# EAGLE design raspberry_aux_board_connectors (EAGLE 9.3.2)

## Sheet 1 of 2
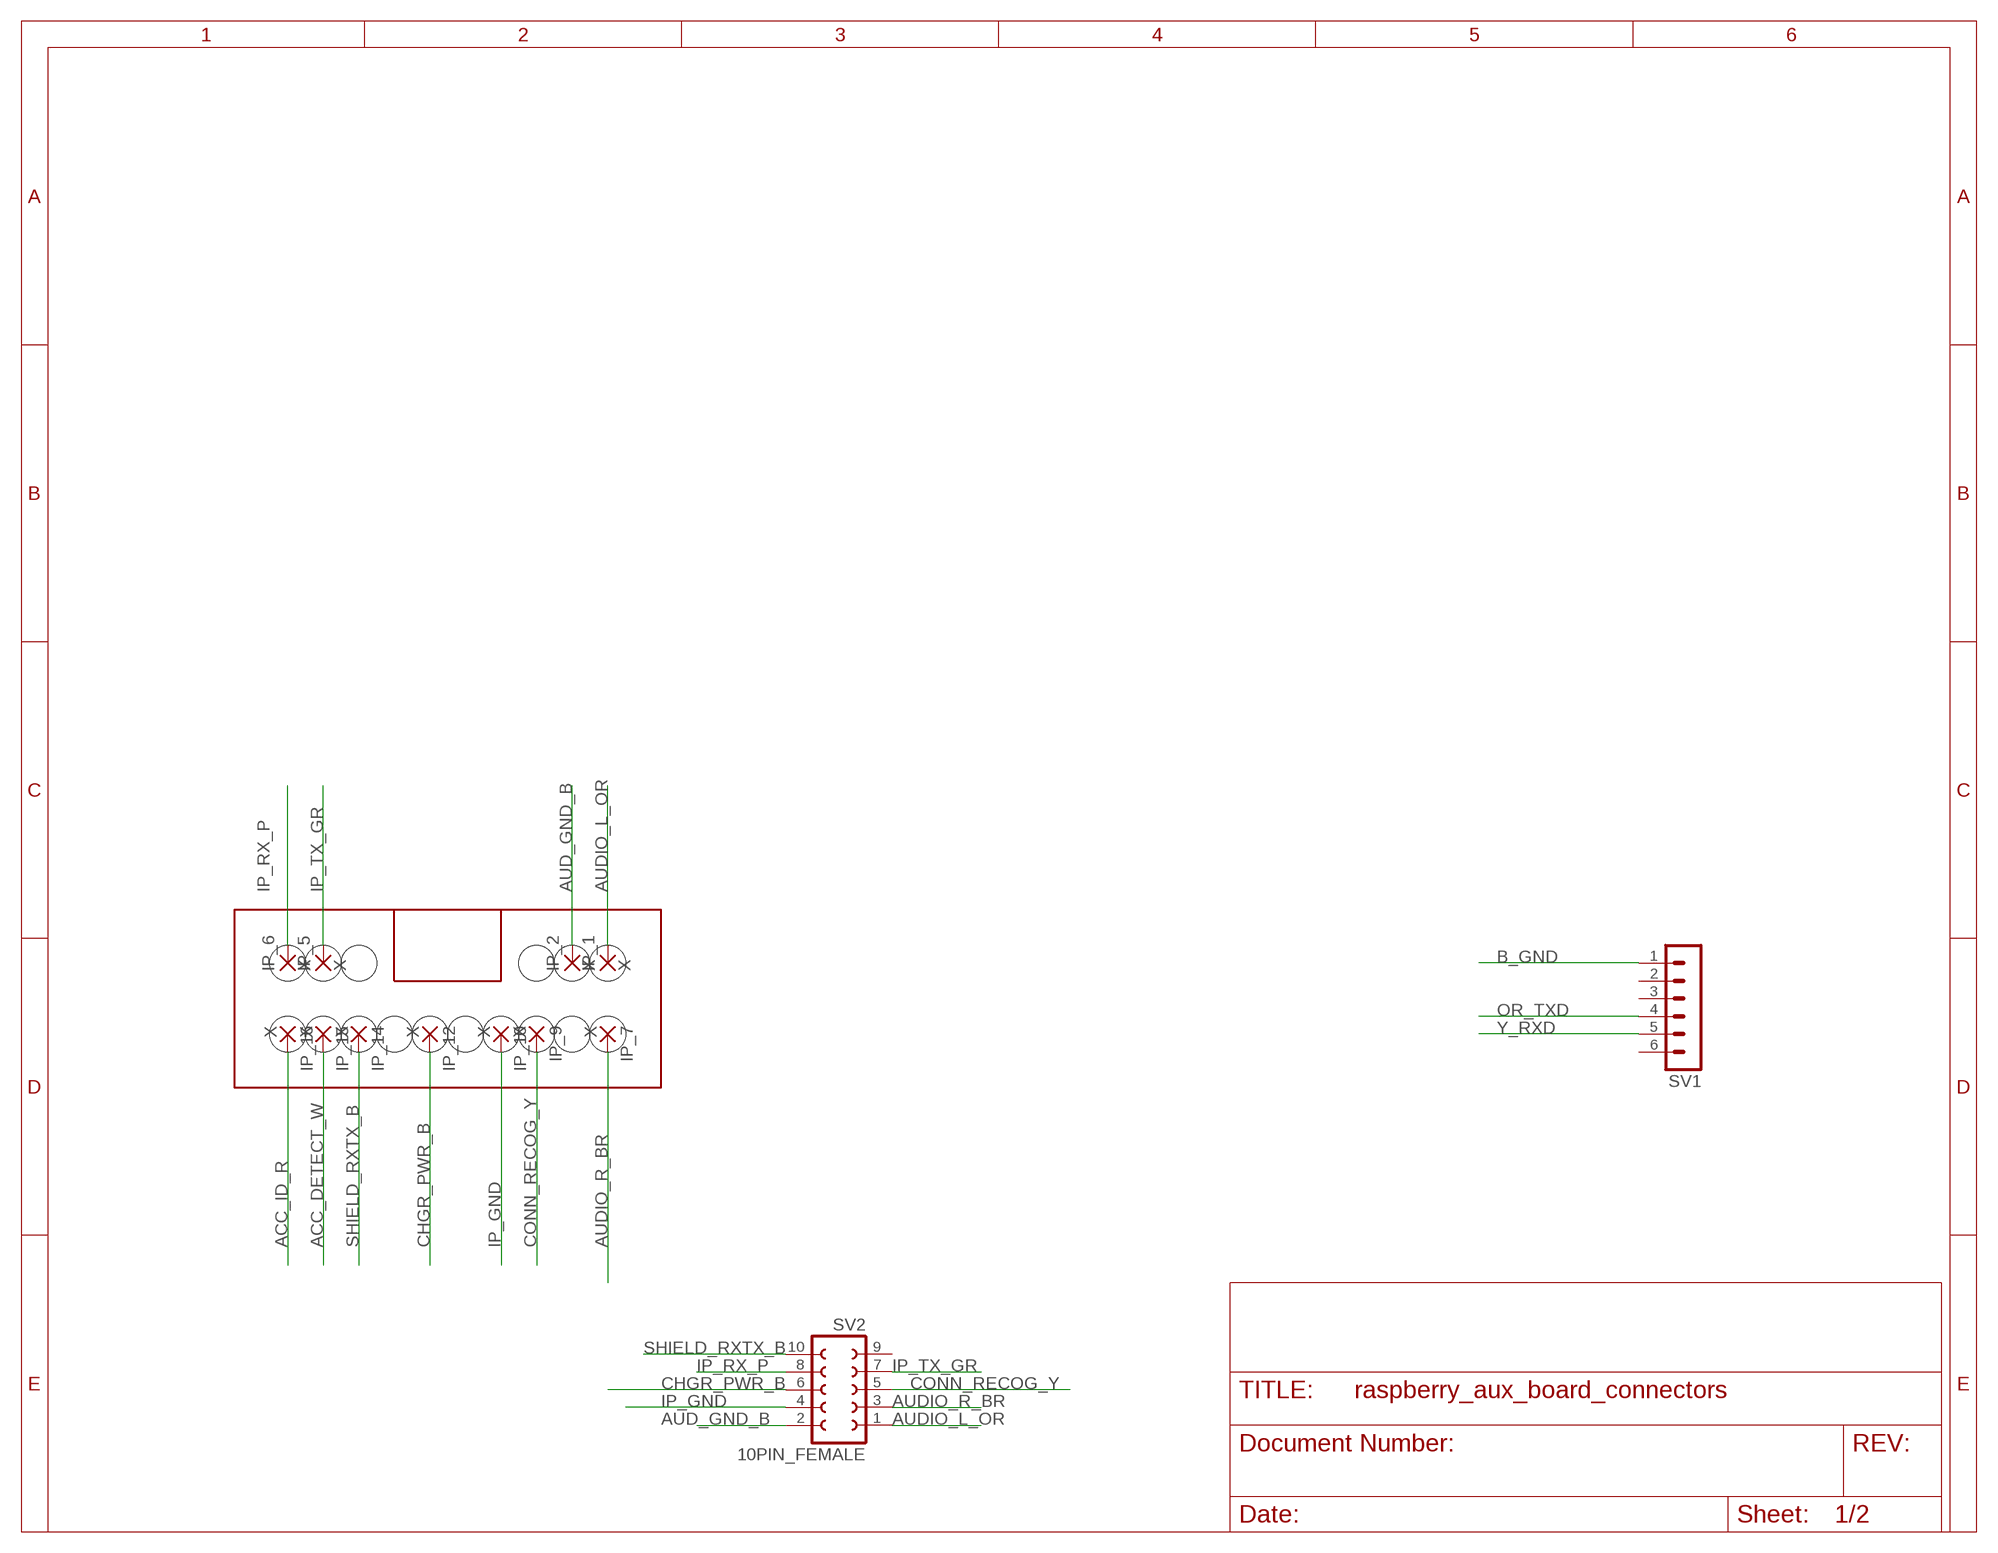
[diagram p0: schematic, sheet 1]

### Parts
IP_1  X  2,15/1,0  [2,15/1,0]
IP_2  X  2,15/1,0  [2,15/1,0]
IP_5  X  2,15/1,0  [2,15/1,0]
IP_6  X  2,15/1,0  [2,15/1,0]
IP_7  X  2,15/1,0  [2,15/1,0]
IP_9  X  2,15/1,0  [2,15/1,0]
IP_10  X  2,15/1,0  [2,15/1,0]
IP_12  X  2,15/1,0  [2,15/1,0]
IP_14  X  2,15/1,0  [2,15/1,0]
IP_15  X  2,15/1,0  [2,15/1,0]
IP_16  X  2,15/1,0  [2,15/1,0]
SV1  MA06-1  [MA06-1]
SV2  10PIN_FEMALE  FE05-2  [FE05-2]

### Nets
ACC_DETECT_W: IP_15.1(P)
ACC_ID_R: IP_16.1(P)
AUD_GND_B: IP_2.1(P) SV2.2
AUDIO_L_OR: IP_1.1(P) SV2.1
AUDIO_R_BR: IP_7.1(P) SV2.3
B_GND: SV1.1
CHGR_PWR_B: IP_12.1(P) SV2.6
CONN_RECOG_Y: IP_9.1(P) SV2.5
IP_GND: IP_10.1(P) SV2.4
IP_RX_P: IP_6.1(P) SV2.8
IP_TX_GR: IP_5.1(P) SV2.7
OR_TXD: SV1.4
SHIELD_RXTX_B: IP_14.1(P) SV2.10
Y_RXD: SV1.5
Unconnected: SV1.2 SV1.3 SV1.6 SV2.9

## Sheet 2 of 2

## Library data of the parts
IP_1 IP_2 IP_5-IP_7 IP_9 IP_10 IP_12 IP_14-IP_16 = wirepad:2,15/1,0: THROUGH-HOLE PAD
SV1 = con-lstb:MA06-1: PIN HEADER; OC_FARNELL: unknown; OC_NEWARK: unknown
SV2 = con-lsta:FE05-2: FEMALE HEADER; OC_FARNELL: unknown; OC_NEWARK: unknown

## Net classes
0 digital_signal: width 0.61 mm, clearance 0.305 mm
1 analog_signal: width 0.61 mm, clearance 0.305 mm
2 power: width 1.219 mm, clearance 0.305 mm

## Board
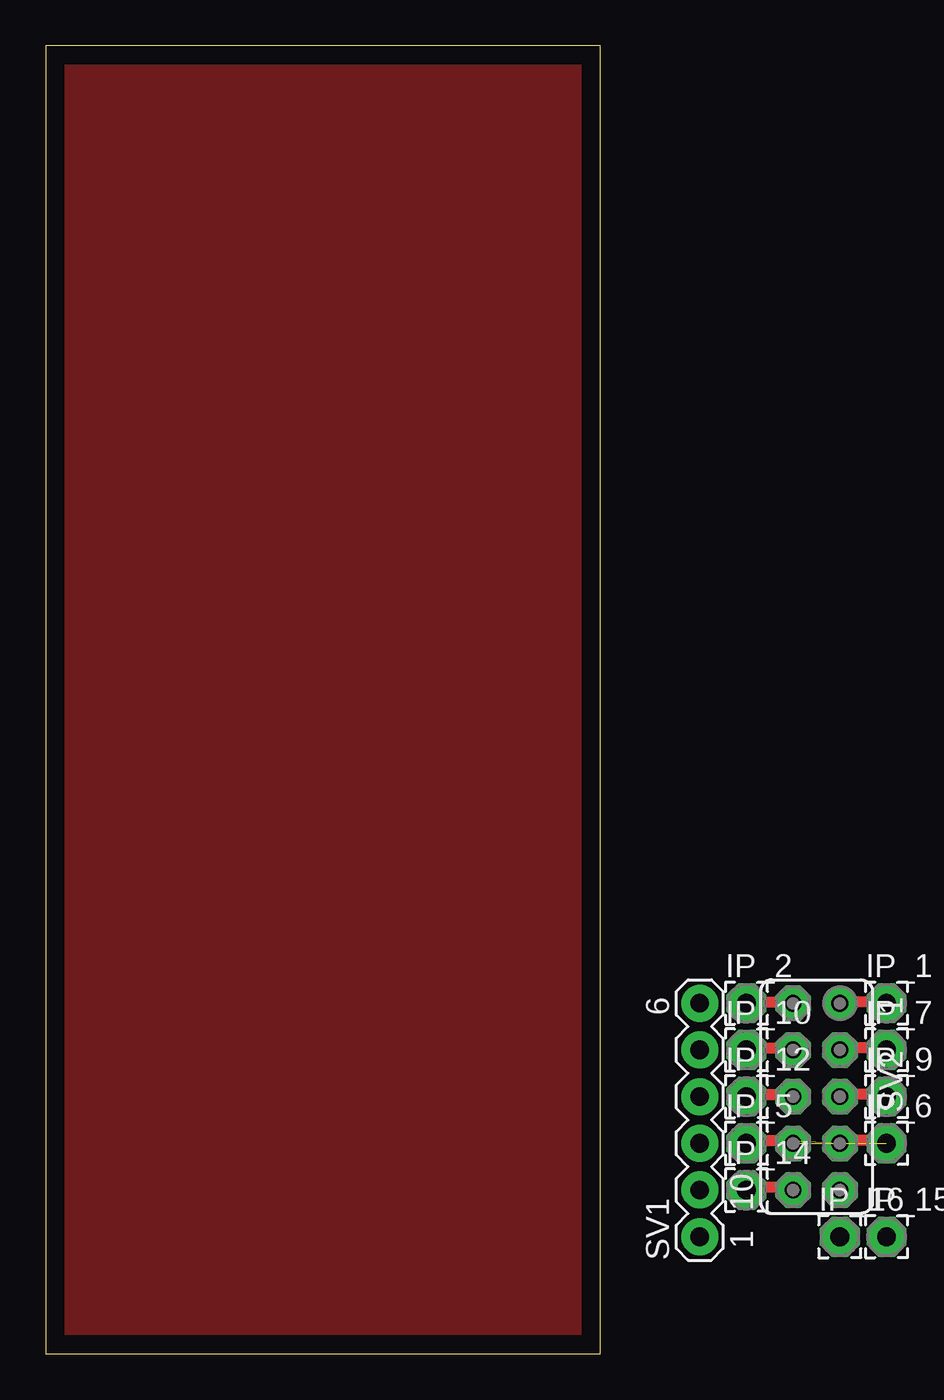
[diagram p1: board, top side]
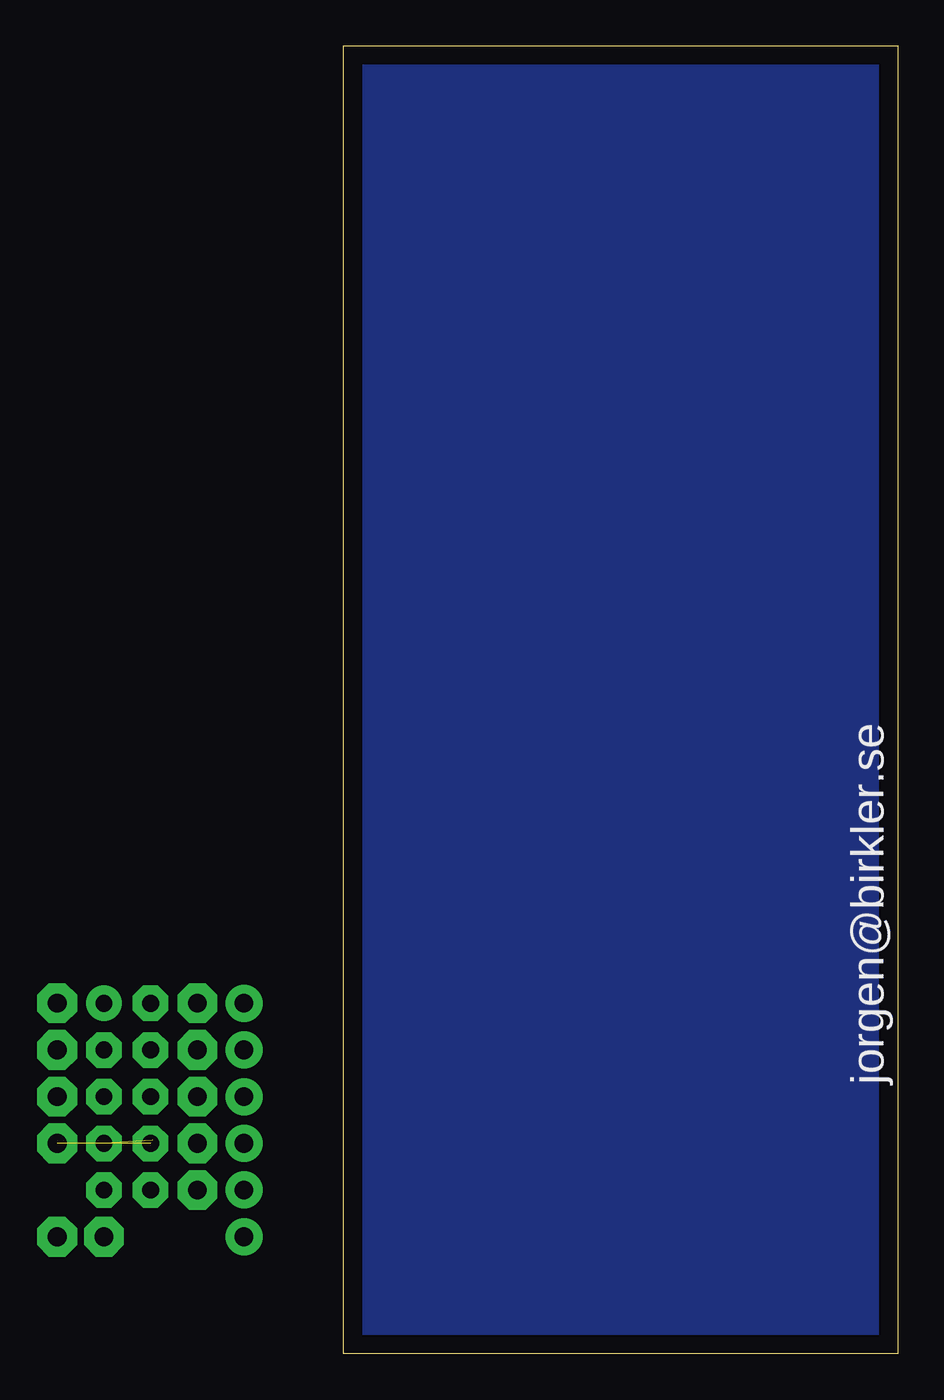
[diagram p2: board, bottom side, seen from below]

Size 30.15 x 71.11 mm. Coordinates in mm from the lower left corner, seen from the top.
Outline: 0,0 30.15,0 30.15,71.11 0,71.11 0,0
Copper layers (1*16): Top 0.035mm / dielectric 1.5mm / Bottom 0.035mm
Design rules "default *": minimum track width 24mil, minimum drill 0.7mm, track to track 6mil, track to pad 6mil, pad to pad 6mil, via to via 6mil, smd to smd 6mil, copper to edge 40mil, drill to drill 6mil, minimum pad ring 20mil, minimum via ring 8mil, stop-mask expansion 4mil, vias tented up to drill 0mil, thermal gap 10mil

### Footprints (pad centres in the part's own frame; a part is rotated, then mirrored left to right if it is on the bottom)
2,15/1,0 = drill 1.016 pad 2.159 octagon: 1 0,0
MA06-1 = drill 1.016 long: 1 -6.35,0; 2 -3.81,0; 3 -1.27,0; 4 1.27,0; 5 3.81,0; 6 6.35,0
FE05-2 = drill 0.914: 1 -5.08,1.27 | drill 0.914 octagon: 2 -5.08,-1.27; 3 -2.54,1.27; 4 -2.54,-1.27; 5 0,1.27; 6 0,-1.27; 7 2.54,1.27; 8 2.54,-1.27; 9 5.08,1.27; 10 5.08,-1.27

### Placement (x,y rotation side)
IP_1  45.72,19.05 0 top  (outside the outline)
IP_2  38.1,19.05 0 top  (outside the outline)
IP_5  38.1,11.43 0 top  (outside the outline)
IP_6  45.72,11.43 0 top  (outside the outline)
IP_7  45.72,16.51 0 top  (outside the outline)
IP_9  45.72,13.97 0 top  (outside the outline)
IP_10  38.1,16.51 0 top  (outside the outline)
IP_12  38.1,13.97 0 top  (outside the outline)
IP_14  38.1,8.89 0 top  (outside the outline)
IP_15  45.72,6.35 0 top  (outside the outline)
IP_16  43.18,6.35 0 top  (outside the outline)
SV1  35.56,12.7 90 top  (outside the outline)
SV2  41.91,13.97 270 top  (outside the outline)

### Tracks (layer width: path | path; a pad name or v marks a point on that pad's centre or on a via)
AUD_GND_B
  Top 0.61: SV2.2 40.54,19.13 38.25,19.13 IP_2.1
AUDIO_L_OR
  Top 0.61: SV2.1 43.28,19.13 45.57,19.13 IP_1.1
AUDIO_R_BR
  Top 0.61: SV2.3 43.28,16.61 45.57,16.61 IP_7.1
CHGR_PWR_B
  Top 0.61: SV2.6 40.54,14.1 38.25,14.1 IP_12.1
CONN_RECOG_Y
  Top 0.61: SV2.5 43.28,14.1 45.57,14.1 IP_9.1
GND
  pour Bottom: 0,71.12 30.48,71.12 30.48,0 0,0
  pour Top: 0,71.12 30.48,71.12 30.48,0 0,0
IP_GND
  Top 0.61: SV2.4 40.54,16.61 38.25,16.61 IP_10.1
IP_RX_P  (1 unrouted)
IP_TX_GR  (1 unrouted)
  Top 0.61: 40.54,11.58 38.25,11.58 IP_5.1 | 45.57,11.58 43.28,11.58 SV2.7
SHIELD_RXTX_B
  Top 0.61: SV2.10 40.54,9.07 38.25,9.07 IP_14.1

### Text on the board
bPlace: jorgen@birkler.se